# EAGLE design rgb_led (EAGLE 9.6.2)
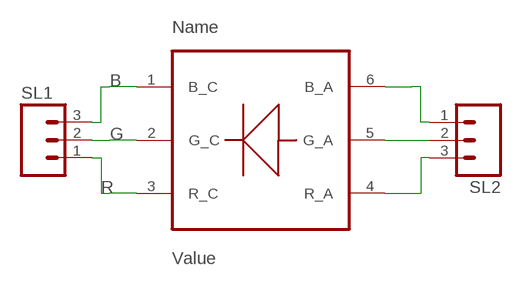
[diagram p0: schematic, sheet 1]

## Parts
SL1  M03  [03P]
SL2  M03  [03P]
U$2  RGB_SMD_3W  [RGB_SMD_6PIN]

## Nets
B: SL1.3 U$2.1(B_C)
G: SL1.2 U$2.2(G_C)
N$1: SL2.1 U$2.6(B_A)
N$2: SL2.2 U$2.5(G_A)
N$3: SL2.3 U$2.4(R_A)
R: SL1.1 U$2.3(R_C)

## Library data of the parts
SL1 SL2 = con-amp-quick:M03: AMP QUICK CONNECTOR; OC_FARNELL: unknown; OC_NEWARK: unknown
U$2 = CEDTv78:RGB_SMD_3W: RGB SMD 3W(1W each)

## Net classes
0 default: width 0.61 mm

## Board
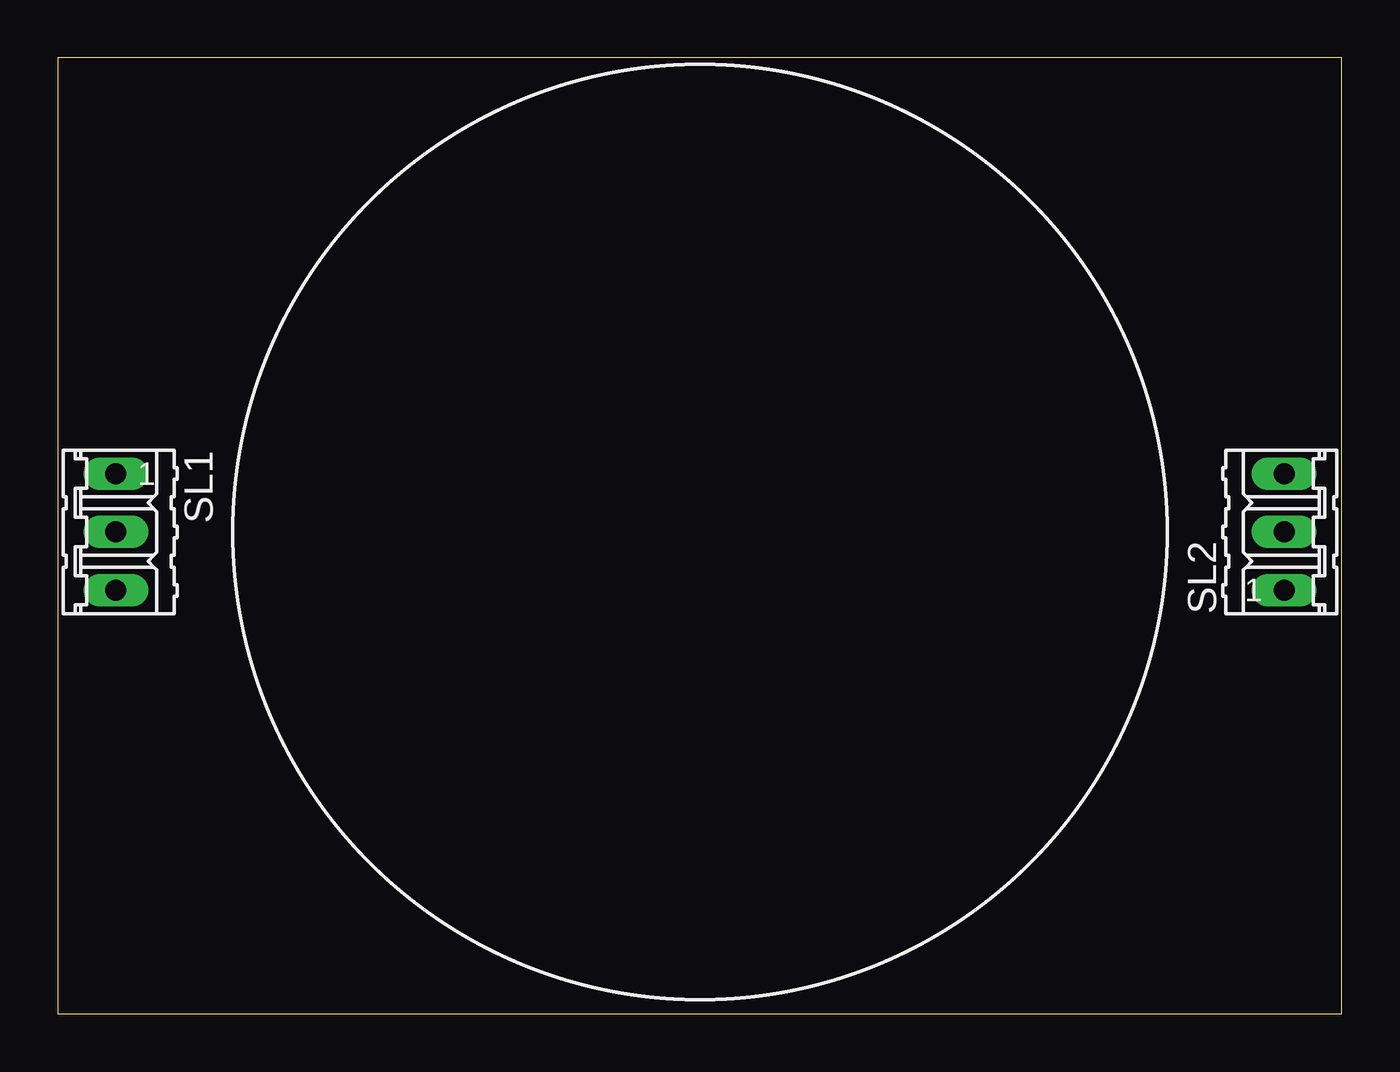
[diagram p1: board, top side]
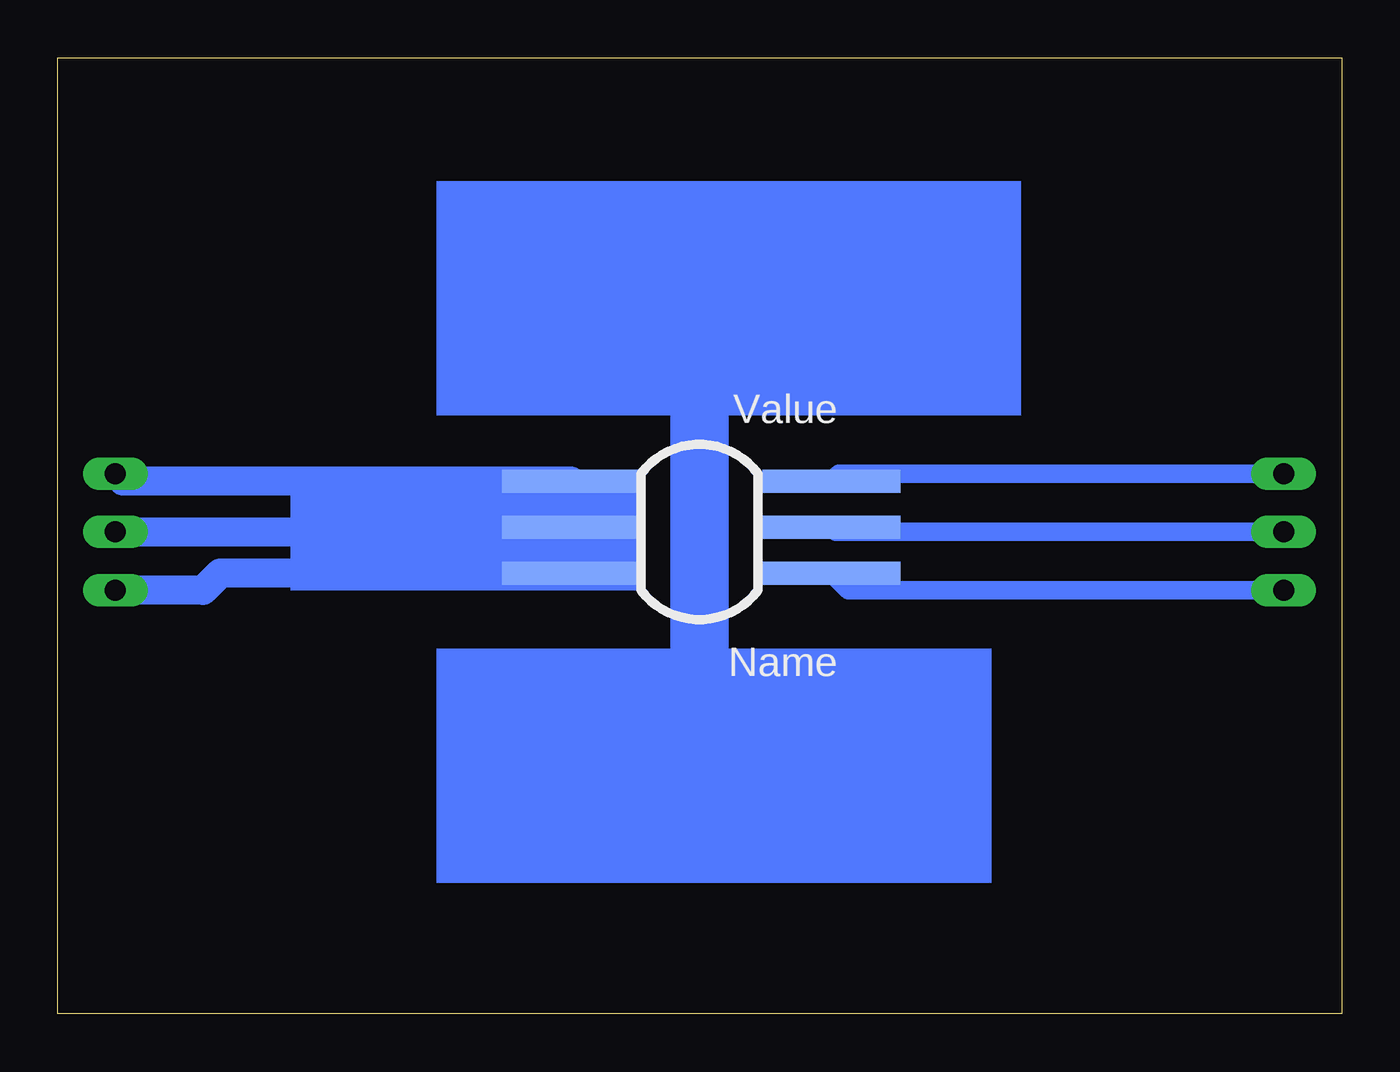
[diagram p2: board, bottom side, seen from below]

Size 55.86 x 41.58 mm. Coordinates in mm from the lower left corner, seen from the top.
Outline: 0,0 55.86,0 55.86,41.58 0,41.58 0,0
Copper layers (1*16): Top 0.035mm / dielectric 1.5mm / Bottom 0.035mm
Design rules "default": minimum track width 6mil, minimum drill 0.35mm, track to track 6mil, track to pad 6mil, pad to pad 6mil, via to via 6mil, smd to smd 6mil, copper to edge 40mil, drill to drill 6mil, minimum pad ring 10mil, minimum via ring 8mil, stop-mask expansion 4mil, vias tented up to drill 0mil, thermal gap 10mil

### Footprints (pad centres in the part's own frame; a part is rotated, then mirrored left to right if it is on the bottom)
03P = drill 0.914 long: 1 -2.54,0; 2 0,0; 3 2.54,0
RGB_SMD_6PIN = smd 6 x 0.998: 1 -5.728,1.795; 2 -5.728,-0.205; 3 -5.728,-2.205; 4 5.59,-2.205; 5 5.59,-0.205; 6 5.59,1.795

### Placement (x,y rotation side)
SL1  2.54,20.95 270 top
SL2  53.34,20.95 90 top
U$2  27.94,20.95 180 bottom

### Tracks (layer width: path | path; a pad name or v marks a point on that pad's centre or on a via)
B
  Bottom 0.813: SL1.3 21.47,18.41 U$2.1
G
  Bottom 0.813: U$2.2 22.01,20.95 SL1.2
N$1
  Bottom 1.27: U$2.6 48.78,19.16 49.53,18.41 SL2.1
N$2
  Bottom 1.27: SL2.2 33.73,20.95 U$2.5
N$3
  Bottom 1.27: U$2.4 53.01,23.16 SL2.3
R
  Bottom 0.813: U$2.3 21.88,23.5 SL1.1
(copper drawn outside any net)
  shapes: Bottom area x4